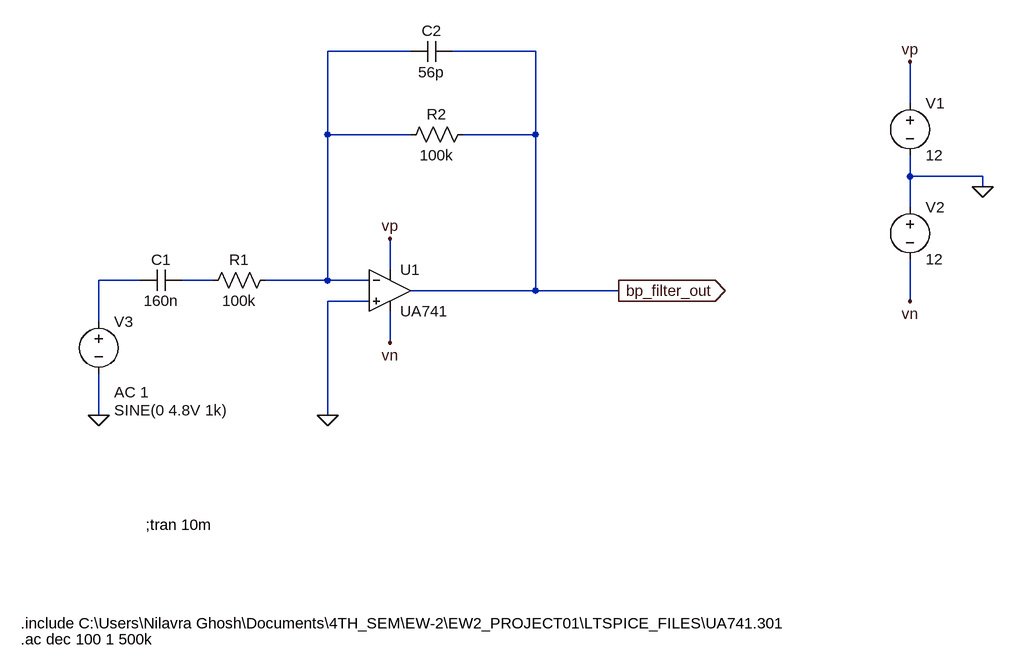
[diagram p0: schematic 3rd_stage_abpfilter.asc]
3rd_stage_abpfilter.asc, the LTspice schematic file:
Version 4
SHEET 1 1060 904
WIRE 160 -16 32 -16
WIRE 352 -16 224 -16
WIRE 928 64 928 0
WIRE 32 112 32 -16
WIRE 160 112 32 112
WIRE 352 112 352 -16
WIRE 352 112 240 112
WIRE 928 176 928 144
WIRE 1040 176 928 176
WIRE 1040 192 1040 176
WIRE 928 224 928 176
WIRE 128 320 128 272
WIRE -256 336 -320 336
WIRE -144 336 -192 336
WIRE 32 336 32 112
WIRE 32 336 -64 336
WIRE 96 336 32 336
WIRE 352 352 352 112
WIRE 352 352 160 352
WIRE 480 352 352 352
WIRE 96 368 32 368
WIRE 928 368 928 304
WIRE -320 400 -320 336
WIRE 128 432 128 384
WIRE -320 544 -320 480
WIRE 32 544 32 368
FLAG 1040 192 0
FLAG 928 0 vp
FLAG 928 368 vn
FLAG 128 272 vp
FLAG 128 432 vn
FLAG 480 352 bp_filter_out
IOPIN 480 352 Out
FLAG -320 544 0
FLAG 32 544 0
SYMBOL OpAmps\\opamp2 128 288 R0
SYMATTR InstName U1
SYMATTR Value UA741
SYMBOL voltage 928 48 R0
WINDOW 123 0 0 Left 0
WINDOW 39 0 0 Left 0
SYMATTR InstName V1
SYMATTR Value 12
SYMBOL voltage 928 208 R0
WINDOW 123 0 0 Left 0
WINDOW 39 0 0 Left 0
SYMATTR InstName V2
SYMATTR Value 12
SYMBOL res -48 320 R90
WINDOW 0 0 56 VBottom 2
WINDOW 3 32 56 VTop 2
SYMATTR InstName R1
SYMATTR Value 100k
SYMBOL voltage -320 384 R0
WINDOW 3 24 152 Left 2
WINDOW 123 24 124 Left 2
WINDOW 39 0 0 Left 0
SYMATTR Value SINE(0 4.8V 1k)
SYMATTR Value2 AC 1
SYMATTR InstName V3
SYMBOL cap -192 320 R90
WINDOW 0 0 32 VBottom 2
WINDOW 3 32 32 VTop 2
SYMATTR InstName C1
SYMATTR Value 160n
SYMBOL res 256 96 R90
WINDOW 0 0 56 VBottom 2
WINDOW 3 32 56 VTop 2
SYMATTR InstName R2
SYMATTR Value 100k
SYMBOL cap 224 -32 R90
WINDOW 0 0 32 VBottom 2
WINDOW 3 32 32 VTop 2
SYMATTR InstName C2
SYMATTR Value 56p
TEXT -440 864 Left 2 !.include C:\\Users\\Nilavra Ghosh\\Documents\\4TH_SEM\\EW-2\\EW2_PROJECT01\\LTSPICE_FILES\\UA741.301
TEXT -440 888 Left 2 !.ac dec 100 1 500k
TEXT -248 712 Left 2 !;tran 10m

The netlist it stands for:
* 3rd_stage_abpfilter.asc
XU1 0 N001 vp vn bp_filter_out UA741  ; pins In+ In- V+ V- OUT
V1 vp 0 12
V2 0 vn 12
R1 N001 N003 100k
V3 N002 0 SINE(0 4.8V 1k) AC 1
C1 N003 N002 160n
R2 bp_filter_out N001 100k
C2 bp_filter_out N001 56p
.include C:\Users\Nilavra Ghosh\Documents\4TH_SEM\EW-2\EW2_PROJECT01\LTSPICE_FILES\UA741.301
.ac dec 100 1 500k
;tran 10m
.backanno
.end